# Altium schematic sheet [08] - PERIPHERALS A.SchDoc
size A4
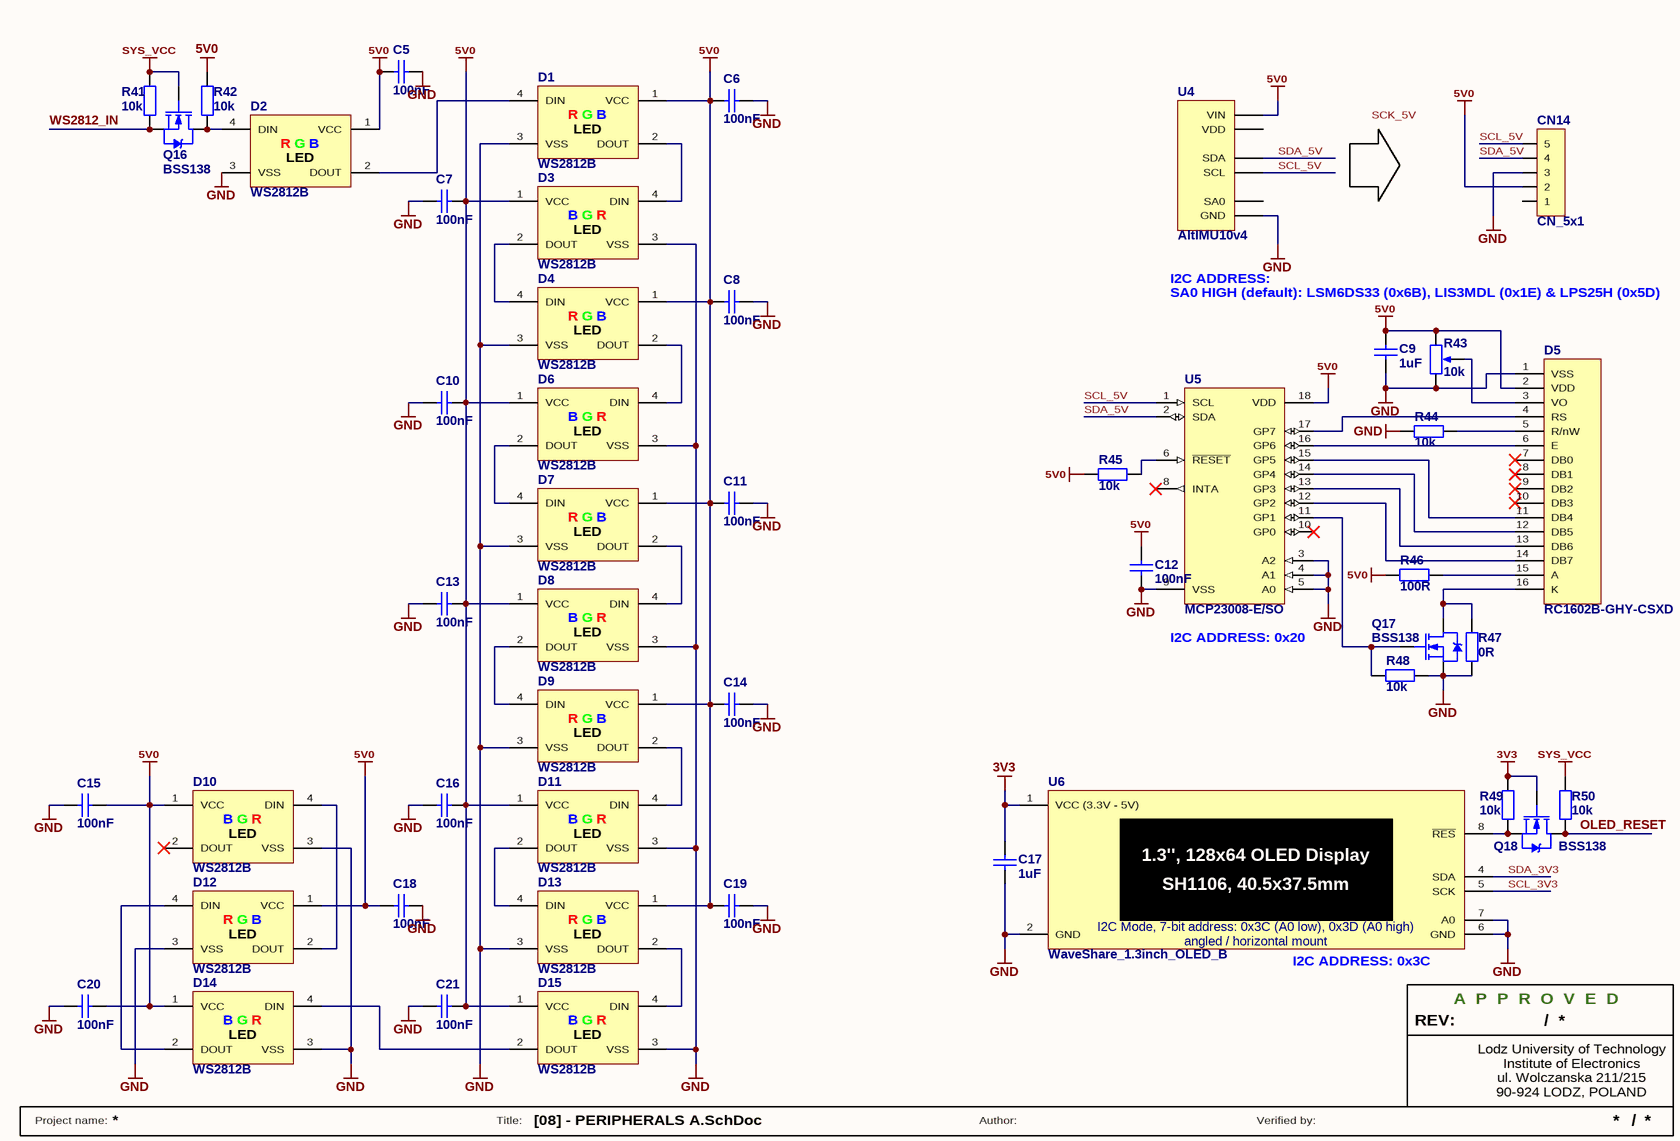
[diagram p0: [08] - PERIPHERALS A.SchDoc]

## Parts
C5  100nF  [C0805]
C6  100nF  [C0805]
C7  100nF  [C0805]
C8  100nF  [C0805]
C9  1uF  [C0805]
C10  100nF  [C0805]
C11  100nF  [C0805]
C12  100nF  [C0805]
C13  100nF  [C0805]
C14  100nF  [C0805]
C15  100nF  [C0805]
C16  100nF  [C0805]
C17  1uF  [C0805]
C18  100nF  [C0805]
C19  100nF  [C0805]
C20  100nF  [C0805]
C21  100nF  [C0805]
CN14  CN_5x1  [GP_5x1H_F]
D1  WS2812B  [WS2812B]
D2  WS2812B  [WS2812B]
D3  WS2812B  [WS2812B]
D4  WS2812B  [WS2812B]
D5  RC1602B-GHY-CSXD  [RC1602B-GHY-CSXD]
D6  WS2812B  [WS2812B]
D7  WS2812B  [WS2812B]
D8  WS2812B  [WS2812B]
D9  WS2812B  [WS2812B]
D10  WS2812B  [WS2812B]
D11  WS2812B  [WS2812B]
D12  WS2812B  [WS2812B]
D13  WS2812B  [WS2812B]
D14  WS2812B  [WS2812B]
D15  WS2812B  [WS2812B]
Q16  BSS138  [SOT-23]
Q17  BSS138  [SOT-23]
Q18  BSS138  [SOT-23]
R41  10k  [R0805]
R42  10k  [R0805]
R43  value 10k  [3305SMD]  (hidden comment: *)
R44  10k  [R0805]
R45  10k  [R0805]
R46  100R  [R0805]
R47  0R  [R0805]
R48  10k  [R0805]
R49  10k  [R0805]
R50  10k  [R0805]
U4  AltIMU10v4  [AltIMU-10 v4_REVERSE]
U5  MCP23008-E/SO  [SO18W]
U6  WaveShare_1.3inch_OLED_B  [WaveShare_1.3INCH_OLED]

## Nets
3V3: C17.2 Q18.1(G) R49.2 U6.1(VCC_(3.3V_-_5V))
5V0: C5.1 C6.1 C7.2 C8.1 C9.2 C10.2 C11.1 C12.2 C13.2 C14.1 C15.2 C16.2 C18.1 C19.1 C20.2 C21.2 CN14.2 D1.1(VCC) D2.1(VCC) D3.1(VCC) D4.1(VCC) D5.2(VDD) D6.1(VCC) D7.1(VCC) D8.1(VCC) D9.1(VCC) D10.1(VCC) D11.1(VCC) D12.1(VCC) D13.1(VCC) D14.1(VCC) D15.1(VCC) R42.2 R43.1(TOP) R45.1 R46.1 U4.3(VIN) U5.18(VDD)
GND: C5.2 C6.2 C7.1 C8.2 C9.1 C10.1 C11.2 C12.1 C13.1 C14.2 C15.1 C16.1 C17.1 C18.2 C19.2 C20.1 C21.1 CN14.3 D1.3(VSS) D2.3(VSS) D3.3(VSS) D4.3(VSS) D5.1(VSS) D6.3(VSS) D7.3(VSS) D8.3(VSS) D9.3(VSS) D10.3(VSS) D11.3(VSS) D12.3(VSS) D13.3(VSS) D14.3(VSS) D15.3(VSS) Q17.2(S) R43.2(BOT) R44.1 R47.2 R48.2 U4.1(GND) U5.3(A2) U5.4(A1) U5.5(A0) U5.9(VSS) U6.2(GND) U6.6(GND) U6.7(A0)
SYS_VCC: Q16.1(G) R41.2 R50.2
OLED_RESET: Q18.3(D) R50.1
SCL_3V3: U6.5(SCK)
SCL_5V: CN14.5 U4.6(SCL) U5.1(SCL)
SDA_3V3: U6.4(SDA)
SDA_5V: CN14.4 U4.5(SDA) U5.2(SDA)
WS2812_IN: Q16.2(S) R41.1
NetD1_2: D1.2(DOUT) D3.4(DIN)
NetD1_4: D1.4(DIN) D2.2(DOUT)
NetD2_4: D2.4(DIN) Q16.3(D) R42.1
NetD3_2: D3.2(DOUT) D4.4(DIN)
NetD4_2: D4.2(DOUT) D6.4(DIN)
NetD5_3: D5.3(VO) R43.3(TAP)
NetD5_4: D5.4(RS) U5.17(GP7)
NetD5_5: D5.5(R/nW) R44.2
NetD5_6: D5.6(E) U5.16(GP6)
NetD5_11: D5.11(DB4) U5.15(GP5)
NetD5_12: D5.12(DB5) U5.14(GP4)
NetD5_13: D5.13(DB6) U5.13(GP3)
NetD5_14: D5.14(DB7) U5.12(GP2)
NetD5_15: D5.15(A) R46.2
NetD5_16: D5.16(K) Q17.3(D) R47.1
NetD6_2: D6.2(DOUT) D7.4(DIN)
NetD7_2: D7.2(DOUT) D8.4(DIN)
NetD8_2: D8.2(DOUT) D9.4(DIN)
NetD9_2: D9.2(DOUT) D11.4(DIN)
NetD10_4: D10.4(DIN) D12.2(DOUT)
NetD11_2: D11.2(DOUT) D13.4(DIN)
NetD12_4: D12.4(DIN) D14.2(DOUT)
NetD13_2: D13.2(DOUT) D15.4(DIN)
NetD14_4: D14.4(DIN) D15.2(DOUT)
NetQ17_1: Q17.1(G) R48.1 U5.11(GP1)
NetQ18_2: Q18.2(S) R49.1 U6.8(~{RES})
NetR45_2: R45.2 U5.6(~{RESET})

Not connected (* = marked no-connect by the designer): CN14 1; D5 7(DB0)* 8(DB1)* 9(DB2)* 10(DB3)*; D10 2(DOUT)*; U4 2(SA0) 4(VDD); U5 8(INTA)* 10(GP0)*

## Notes on the sheet
- SA0 HIGH (default): LSM6DS33 (0x6B), LIS3MDL (0x1E) & LPS25H (0x5D)
- I2C ADDRESS:
- I2C ADDRESS: 0x20
- (near U6) I2C ADDRESS: 0x3C
- Labels drawn without touching a wire or pin: SCK_5V
- REV:
- A  P  P  R  O  V  E  D
- /
- Lodz University of Technology
- ul. Wolczanska 211/215
- 90-924 LODZ, POLAND
- Institute of Electronics
- Project name:
- Title:
- Author:
- Verified by:
- (in symbol WaveShare_1.3inch_OLED) 1.3'', 128x64 OLED Display; SH1106, 40.5x37.5mm; I2C Mode, 7-bit address: 0x3C (A0 low), 0x3D (A0 high); angled / horizontal mount
- (in symbol WS2812B) R; G; B; LED

## Library data of the parts
C5-C21 = Cap: Capacitor; ComponentLink1Description: datasheet; ComponentLink2Description: supplier
  C5-C8 C10-C16 C18-C21: Value: 100nF
  C9 C17: Value: 1uF
D1-D4 D6-D15 = WS2812B: Intelligent control LED integrated light source
D5 = RC1602B-GHY-CSXD: 16x2 LCD Display
Q16-Q18 = BSS138: N-Channel Enhancement Mode Vertical DMOS FET; Published: 17-Dec-2003; DatasheetVersion: Mar-96; PackageVersion: 1996; PackageReference: SOT23; Publisher: Altium Limited; PackageDescription: SOT-23; 3 Leads; Body 3.1 x 2.5 mm, inc. leads (LxW max), Alternate Lead Configuration; ComponentLink1Description: Manufacturer Link; ComponentLink1URL: http://www.zetex.com/; ComponentLink2Description: Datasheet; ComponentLink2URL: www.zetex.com/3.0/pdf/BSS138.pdf
R41 R42 R44-R50 = Res: Resistor; Published: 19-Feb-2006; ComponentLink1Description: datasheet; ComponentLink2Description: supplier
  R41 R42 R44 R45 R48-R50: Value: 10k
  R46: Value: 100R
  R47: Value: 0R
R43 = 3305SMD-10K: Published: 21-10-2009; ComponentLink1Description: datasheet; ComponentLink2Description: supplier
U4 = AltIMU10v4: Pololu Gyro, Accelerometer, Compass, and Altimeter (L3GD20H, LSM303D, and LPS25H Carrier)
U5 = MCP23008-E/SO: 8-Bit I/O Expander with Serial Interface I2C, 18-Pin SOIC Package
U6 = WaveShare_1.3inch_OLED: DEP096032B-W OLED Display